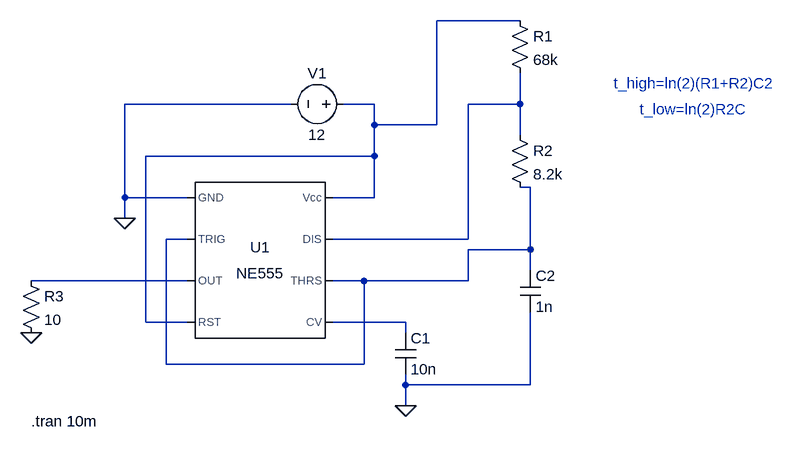
[diagram p0: schematic LM555_Astable_Mode.asc]
LM555_Astable_Mode.asc, the LTspice schematic file:
Version 4
SHEET 1 956 680
WIRE 528 -208 400 -208
WIRE 176 -80 -80 -80
WIRE 304 -80 256 -80
WIRE 528 -80 528 -128
WIRE 528 -80 448 -80
WIRE 304 -48 304 -80
WIRE 400 -48 400 -208
WIRE 400 -48 304 -48
WIRE 528 -32 528 -80
WIRE 304 0 304 -48
WIRE 304 0 -48 0
WIRE 544 48 528 48
WIRE -80 64 -80 -80
WIRE 16 64 -80 64
WIRE 304 64 304 0
WIRE 304 64 240 64
WIRE -80 96 -80 64
WIRE 16 128 -16 128
WIRE 448 128 448 -80
WIRE 448 128 240 128
WIRE 544 144 544 48
WIRE 544 144 448 144
WIRE 544 176 544 144
WIRE 16 192 -224 192
WIRE 288 192 240 192
WIRE 448 192 448 144
WIRE 448 192 288 192
WIRE -48 256 -48 0
WIRE 16 256 -48 256
WIRE 352 256 240 256
WIRE 352 272 352 256
WIRE -16 320 -16 128
WIRE 288 320 288 192
WIRE 288 320 -16 320
WIRE 352 352 352 336
WIRE 544 352 544 240
WIRE 544 352 352 352
WIRE 352 384 352 352
FLAG -80 96 0
FLAG 352 384 0
FLAG -224 272 0
SYMBOL Misc\\NE555 128 160 R0
SYMATTR InstName U1
SYMBOL voltage 272 -80 R90
WINDOW 0 -32 56 VBottom 2
WINDOW 3 32 56 VTop 2
WINDOW 123 0 0 Left 0
WINDOW 39 0 0 Left 0
SYMATTR InstName V1
SYMATTR Value 12
SYMBOL cap 336 272 R0
SYMATTR InstName C1
SYMATTR Value 10n
SYMBOL res 512 -224 R0
SYMATTR InstName R1
SYMATTR Value 68k
SYMBOL res 512 -48 R0
SYMATTR InstName R2
SYMATTR Value 8.2k
SYMBOL cap 528 176 R0
SYMATTR InstName C2
SYMATTR Value 1n
SYMBOL res -240 176 R0
SYMATTR InstName R3
SYMATTR Value 10
TEXT -224 408 Left 2 !.tran 10m
TEXT 672 -112 Left 2 ;t_high=ln(2)(R1+R2)C2
TEXT 712 -72 Left 2 ;t_low=ln(2)R2C

The netlist it stands for:
* LM555_Astable_Mode.asc
XU1 0 N003 N004 N001 N005 N003 N002 N001 NE555  ; pins GND TRIG OUT RST CV THRS DIS Vcc
V1 N001 0 12
C1 N005 0 10n
R1 N001 N002 68k
R2 N002 N003 8.2k
C2 N003 0 1n
R3 N004 0 10
.tran 10m
* t_high=ln(2)(R1+R2)C2
* t_low=ln(2)R2C
.lib NE555.sub
.backanno
.end